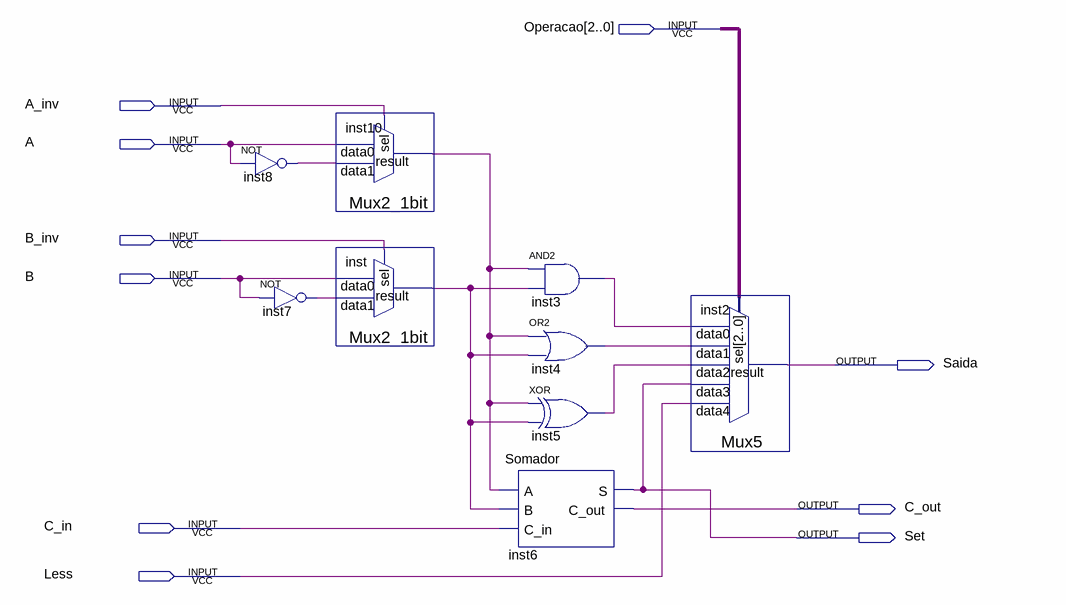
[diagram p0: schematic sheet]
// Quartus schematic ULA_1bit.bdf as structural Verilog: 9 symbols, 10 pins
module ULA_1bit (
  input  [2:0] Operacao,
  input  A_inv,
  input  A,
  input  B_inv,
  input  B,
  input  C_in,
  input  Less,
  output Saida,
  output C_out,
  output Set
);

  wire inst3_out, inst4_out, inst5_out, inst7_out, inst8_out, inst10_result, inst_result;

  not inst8 (inst8_out, A);
  not inst7 (inst7_out, B);
  Mux2_1bit inst10 (.data1(inst8_out), .data0(A), .sel(A_inv), .result(inst10_result));
  Mux2_1bit inst (.data1(inst7_out), .data0(B), .sel(B_inv), .result(inst_result));
  Somador inst6 (.A(inst10_result), .B(inst_result), .C_in(C_in), .S(Set), .C_out(C_out));
  and inst3 (inst3_out, inst10_result, inst_result);
  or inst4 (inst4_out, inst10_result, inst_result);
  xor inst5 (inst5_out, inst10_result, inst_result);
  Mux5 inst2 (
    .data4(Less), .data3(Set), .data2(inst5_out), .data1(inst4_out), .data0(inst3_out), .sel(Operacao),
    .result(Saida));
endmodule
